# Altium schematic sheet adc.SchDoc
size A4
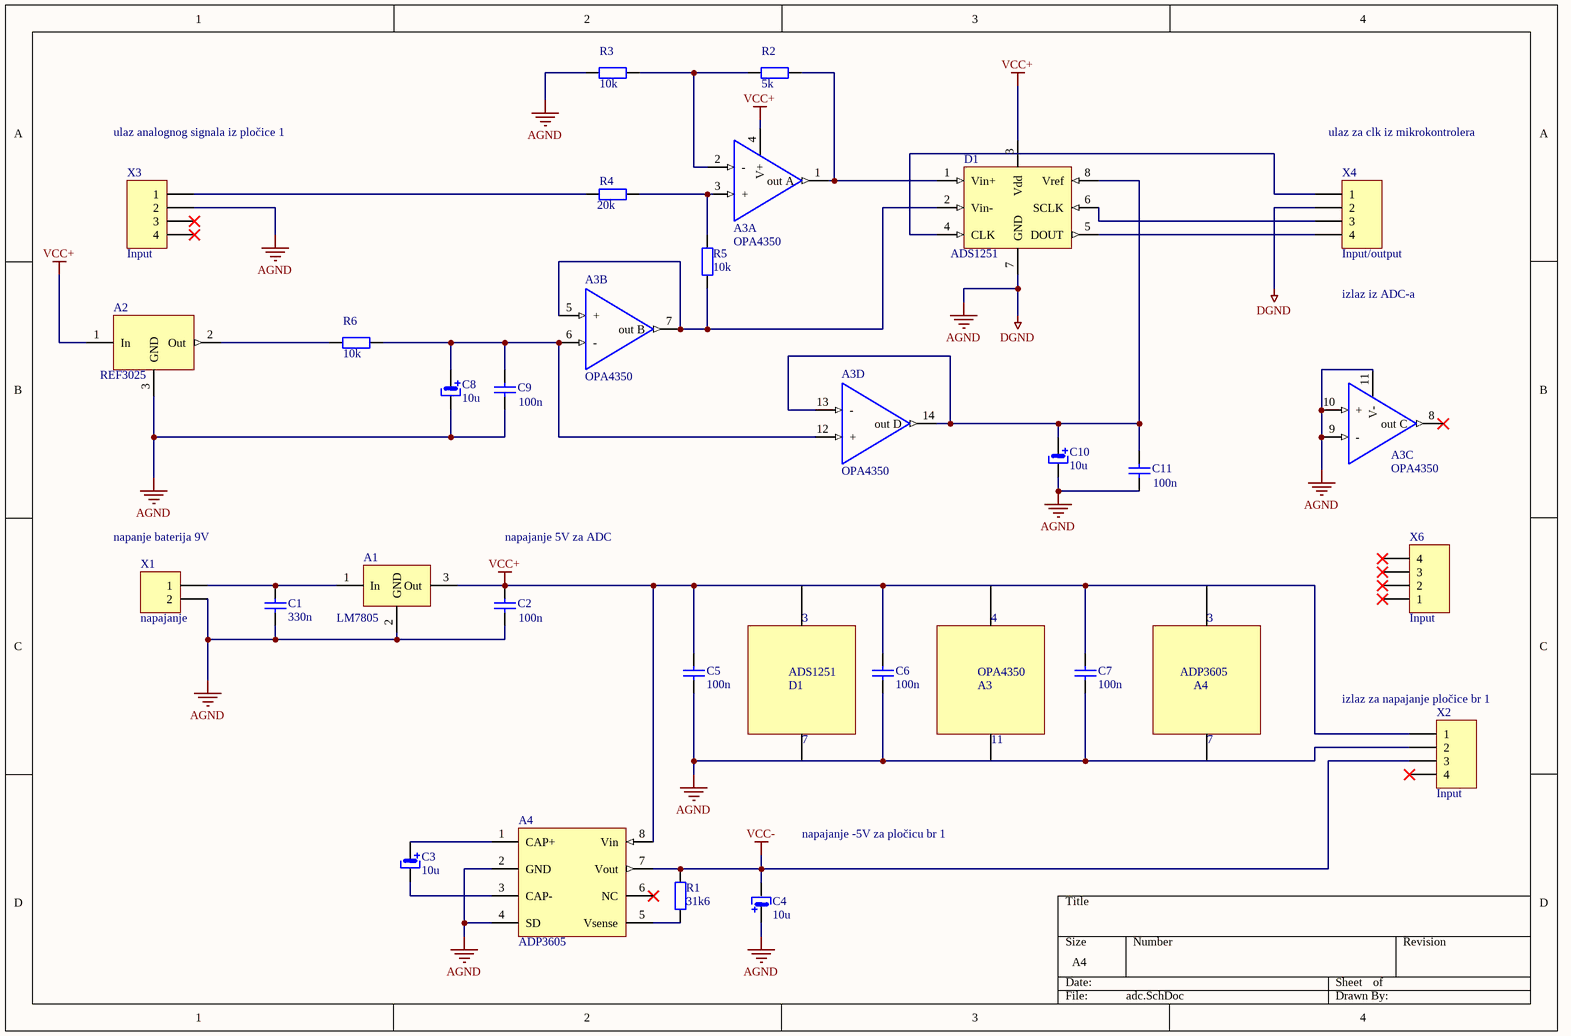
[diagram p0: adc.SchDoc]

## Parts
A1  LM7805  [TO-220-AB]
A2  REF3025  [SOT95P245X112-3N]
A3  OPA4350  [SOIC127P600X175-14N]  (parts A,B,C,D of 4)
A4  ADP3605  [SO8_N]
C1  330n  [C0805]
C2  100n  [C0805]
C3  10u  [C0805]
C4  10u  [C0805]
C5  100n  [C0805]
C6  100n  [C0805]
C7  100n  [C0805]
C8  10u  [C0805]
C9  100n  [C0805]
C10  10u  [C0805]
C11  100n  [C0805]
D1  ADS1251  [SOIC127P600X175-8N]
R1  31k6  [C0805]
R2  5k  [C0805]
R3  10k  [C0805]
R4  20k  [C0805]
R5  10k  [C0805]
R6  10k  [C0805]
X1  napajanje  [HDR1X2]
X2  Input  [HDR1X4]
X3  Input  [HDR1X4]
X4  Input/output  [HDR1X4]
X6  Input  [HDR1X4]

## Nets
AGND: A1.2(GND) A2.3(GND) A3.9(-) A3.10(+) A3.11(V-) A4.2(GND) A4.4(SD) C1.1 C2.1 C4.1 C5.1 C6.1 C7.1 C8.2 C9.1 C10.2 C11.1 D1.7(GND) R3.2 X1.2 X2.2 X3.2 X4.2  [also labelled DGND]
VCC+: A1.3(Out) A2.1(In) A3.4(V+) A4.8(Vin) C2.2 C5.2 C6.2 C7.2 D1.3(Vdd) X2.1
VCC-: A4.7(Vout) C4.2 R1.2 X2.3
NetA1_1: A1.1(In) C1.2 X1.1
NetA2_2: A2.2(Out) R6.2
NetA3_1: A3.1(out_A) D1.1(Vin+) R2.1
NetA3_2: A3.2(-) R2.2 R3.1
NetA3_3: A3.3(+) R4.1 R5.1
NetA3_5: A3.5(+) A3.7(out_B) D1.2(Vin-) R5.2
NetA3_6: A3.6(-) A3.12(+) C8.1 C9.2 R6.1
NetA3_13: A3.13(-) A3.14(out_D) C10.1 C11.2 D1.8(Vref)
NetA4_1: A4.1(CAP+) C3.1
NetA4_3: A4.3(CAP-) C3.2
NetA4_5: A4.5(Vsense) R1.1
NetD1_4: D1.4(CLK) X4.1
NetD1_5: D1.5(DOUT) X4.4
NetD1_6: D1.6(SCLK) X4.3
NetR4_2: R4.2 X3.1

Not connected (* = marked no-connect by the designer): A3 8(out_C)*; A4 6(NC)*; X2 4*; X3 3* 4*; X6 1* 2* 3* 4*

## Notes on the sheet
- ulaz analognog signala iz pločice 1
- ulaz za clk iz mikrokontrolera
- izlaz iz ADC-a
- (near X1) napanje baterija 9V
- napajanje 5V za ADC
- 3
- 4
- (near C6) ADS1251
- D1
- A3
- OPA4350
- ADP3605
- A4
- (near X2) izlaz za napajanje pločice br 1
- 7
- 11
- napajanje -5V za pločicu br 1

## Library data of the parts
A1 = LM7805: cijena [kn]: $1.54; Kat.broj: 296-47192-ND; dobavljać: Digi-Key
A2 = REF3040: cijena [kn]: 19,69; Kat.broj: 461-9541; dobavljać: RS Components
A3 = OPA4350: cijena [kn]: 145,00; Kat.broj: 461-8958; dobavljać: RS Components
A4 = ADP3605: cijena [kn]: 35,62; Kat.broj: 159-7701; dobavljać: RS Components
C1 = Cap: Capacitor; Value: 100pF; cijena [kn]: 7,06; Kat.broj: 915-9467; dobavljać: RS Components; Published: 8-Jun-2000; LatestRevisionDate: 17-Jul-2002; LatestRevisionNote: Re-released for DXP Platform.; PackageReference: RAD-0.3; Publisher: Altium Limited; PackageDescription: Radial Cap, Thru-Hole; 2 Leads; 0.3 in Pin Spacing
C2 C5-C7 C9 C11 = Cap: Capacitor; Value: 100pF; cijena [kn]: 0,88; Kat.broj: 264-4416; dobavljać: RS Components; Published: 8-Jun-2000; LatestRevisionDate: 17-Jul-2002; LatestRevisionNote: Re-released for DXP Platform.; PackageReference: RAD-0.3; Publisher: Altium Limited; PackageDescription: Radial Cap, Thru-Hole; 2 Leads; 0.3 in Pin Spacing
C3 C4 C8 C10 = elko2: cijena [kn]: 36,88; Kat.broj: 144-2513; dobavljać: RS Components
D1 = ADS1251: cijena [kn]: 163,75; Kat.broj: 662-0023; dobavljać: RS Components
R1 = Res2: Resistor; Value: 1K; cijena [kn]: 2,50; Kat.broj: 840-5214; dobavljać: RS Components; Published: 8-Jun-2000; LatestRevisionDate: 17-Jul-2002; LatestRevisionNote: Re-released for DXP Platform.; PackageReference: AXIAL-0.4; Publisher: Altium Limited; PackageDescription: Axial Device, Thru-Hole; 2 Leads; 0.4 in Pin Spacing
R2 = Res2: Resistor; Value: 1K; cijena [kn]: 4,25; Kat.broj: 708-6339; dobavljać: RS Components; Published: 8-Jun-2000; LatestRevisionDate: 17-Jul-2002; LatestRevisionNote: Re-released for DXP Platform.; PackageReference: AXIAL-0.4; Publisher: Altium Limited; PackageDescription: Axial Device, Thru-Hole; 2 Leads; 0.4 in Pin Spacing
R3 R5 R6 = Res2: Resistor; Value: 1K; cijena [kn]: 7,44; Kat.broj: 565-948; dobavljać: RS Components; Published: 8-Jun-2000; LatestRevisionDate: 17-Jul-2002; LatestRevisionNote: Re-released for DXP Platform.; PackageReference: AXIAL-0.4; Publisher: Altium Limited; PackageDescription: Axial Device, Thru-Hole; 2 Leads; 0.4 in Pin Spacing
R4 = Res2: Resistor; Value: 1K; cijena [kn]: 8,50; Kat.broj: 125-1185; dobavljać: RS Components; Published: 8-Jun-2000; LatestRevisionDate: 17-Jul-2002; LatestRevisionNote: Re-released for DXP Platform.; PackageReference: AXIAL-0.4; Publisher: Altium Limited; PackageDescription: Axial Device, Thru-Hole; 2 Leads; 0.4 in Pin Spacing
X1 = Header 2H: Header, 2-Pin, Right Angle; LatestRevisionDate: 17-Jul-2002; LatestRevisionNote: Re-released for DXP Platform.; Publisher: Altium Limited
X2-X4 X6 = Header 4H: Header, 4-Pin, Right Angle; LatestRevisionDate: 17-Jul-2002; LatestRevisionNote: Re-released for DXP Platform.; Publisher: Altium Limited